# Altium schematic sheet GY_NEO6MV2_Sheet1.SchDoc
size A4; SheetNumber: 6; SheetTotal: 11
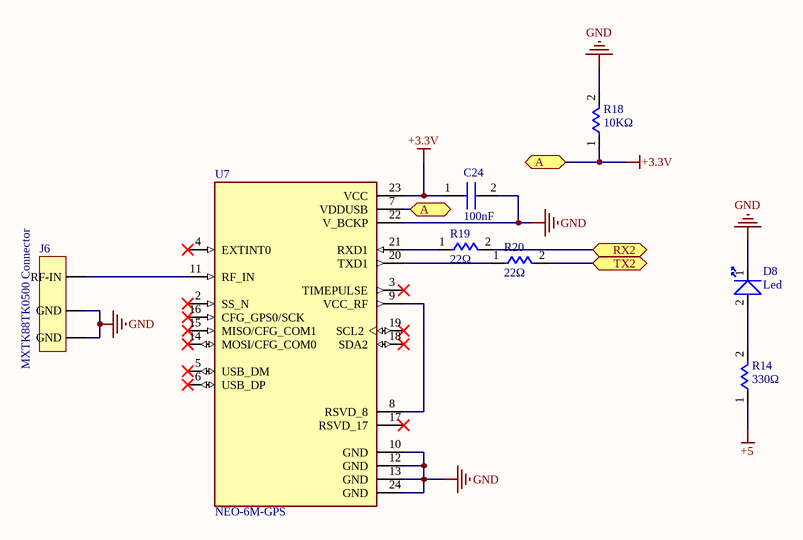
[diagram p0: GY_NEO6MV2_Sheet1.SchDoc]

## Parts
C24  100nF  [CAP - 0603]
D8  Led  [LED - 0603]
J6  MXTK88TK0500 Connector  [MXTK88TK0500 Connector]
R14  330Ω  [RES - 0603]
R18  10KΩ  [RES - 0603]
R19  22Ω  [RES - 0603]
R20  22Ω  [RES - 0603]
U7  NEO-6M-GPS  [XCVR_NEO-6M-GPS]

## Ports
A (bidir), RX2 (bidir), TX2 (bidir)

## Nets
+3.3V: C24.1 R18.1 U7.7(VDDUSB) U7.23(VCC) ; port A
+5: R14.1
GND: C24.2 D8.1 J6.1(GND) J6.2(GND) R18.2 U7.10(GND) U7.12(GND) U7.13(GND) U7.22(V_BCKP) U7.24(GND)
RX2: R19.2 ; port RX2
TX2: R20.2 ; port TX2
NetD8_2: D8.2 R14.2
NetJ6_3: J6.3(RF-IN) U7.11(RF_IN)
NetR19_1: R19.1 U7.21(RXD1)
NetR20_1: R20.1 U7.20(TXD1)
NetU7_8: U7.8(RSVD_8) U7.9(VCC_RF)

Not connected (* = marked no-connect by the designer): U7 2(SS_N)* 3(TIMEPULSE)* 4(EXTINT0)* 5(USB_DM)* 6(USB_DP)* 14(MOSI/CFG_COM0)* 15(MISO/CFG_COM1)* 16(CFG_GPS0/SCK)* 17(RSVD_17)* 18(SDA2)* 19(SCL2)*

## Library data of the parts
C24 = CAP: Capacitor; ComponentLink1Description: Satın Alma Linki; ComponentLink1URL: https://ozdisan.com/pasif-komponentler/kondansatorler/smt-smd-ve-mlcc-kondansatorler/CL10B472KB8NNNC; ComponentLink2Description: Satın Alma Linki; ComponentLink2URL: https://ozdisan.com/pasif-komponentler/kondansatorler/smt-smd-ve-mlcc-kondansatorler/CL10C200JB8NNNC; ComponentLink3Description: Satın Alma Linki; ComponentLink3URL: https://ozdisan.com/pasif-komponentler/kondansatorler/smt-smd-ve-mlcc-kondansatorler/CL10B104KB8NNNC; ComponentLink4Description: Datasheet; ComponentLink4URL: https://cdn.ozdisan.com/ETicaret_Dosya/448212_5798276.PDF; ComponentLink5Description: Satın Alma Linki; ComponentLink5URL: https://ozdisan.com/pasif-komponentler/kondansatorler/smt-smd-ve-mlcc-kondansatorler/CL10C101JB8NNNC
D8 = Led: HL-PST-1608U51GC - LED SMD 0603 GREEN 500mcd 120° WATER CLEAR; ComponentLink1Description: Satın Alma Linki; ComponentLink1URL: https://ozdisan.com/Product/Detail/471660/HL-PST-1608U51GC; ComponentLink2Description: Datasheet; ComponentLink2URL: https://cdn.ozdisan.com/ETicaret_Dosya/471660_7204356.pdf
J6 = MXTK88TK0500 Connector: CABLE ASSEMBLY COAXIAL 0.5m GSC CONN.PL-PL; ComponentLink1Description: Datashet; ComponentLink1URL: https://www.robo90.com/ufl-rf-konnektor-smd-ipex-pcb-konnektor?gclid=Cj0KCQiAjJOQBhCkARIsAEKMtO3EQQtFxcQxxYyV63gND7p49a9U-0KiGjZnTbRHjlZa4_YkA7jEr6QaAmQAEALw_wcB; ComponentLink2Description: Satın Alma Linki; ComponentLink2URL: https://ozdisan.com/konnektor-ve-baglanti-elemanlari/koaksiyel-konnektorler/koaksiyel-kablo-birlestiricileri/MXTK88TK0500
R14 R18-R20 = Res: SMD Res; ComponentLink1Description: Datasheet; ComponentLink1URL: https://cdn.ozdisan.com/ETicaret_Dosya/570122_9878629.pdf; ComponentLink2Description: Satın Alma Linki; ComponentLink2URL: https://www.ozdisan.com/pasif-komponentler/direncler/smt-smd-direncler/TC0325B3301T5C; ComponentLink3Description: Satın Alma Linki; ComponentLink3URL: https://ozdisan.com/pasif-komponentler/direncler/smt-smd-ve-cip-direncler/0603SAF4701T5E; ComponentLink4Description: Satın Alma Linki; ComponentLink4URL: https://ozdisan.com/pasif-komponentler/direncler/smt-smd-ve-cip-direncler/0805S8F604JT5E; ComponentLink5Description: Satın Alma Linki; ComponentLink5URL: https://ozdisan.com/pasif-komponentler/direncler/smt-smd-ve-cip-direncler/0603SAF1022T5E; ComponentLink6Description: Satın Alma Linki; ComponentLink6URL: https://www.ozdisan.com/pasif-komponentler/direncler/smt-smd-direncler/CQ03SAF0000T5E
U7 = NEO-6M-GPS: SMD GPS Module;; MF: u-blox; Availability: Unavailable; MP: NEO-6M-GPS; Package: None; SnapEDA_Link: https://www.snapeda.com/parts/NEO-6M-GPS/u-blox/view-part/105879/?ref=snap; Value: *; Price: None; ComponentLink1Description: Datasheet; ComponentLink1URL: https://cdn.ozdisan.com/ETicaret_Dosya/634963_988117.PDF; ComponentLink2Description: Datasheet; ComponentLink2URL: https://www.u-blox.com/sites/default/files/products/documents/LEA-NEO-MAX-6_HIM_%28UBX-14054794%29.pdf?utm_source=en%2Fimages%2Fdownloads%2FProduct_Docs%2FLEA-6_NEO-6_MAX-6_HardwareIntegrationManual_%28GPS.G6-HW-09007%29.pdf#page=33&zoom=100,72,125; ComponentLink3Description: Satın Alma Linki; ComponentLink3URL: https://www.robo90.com/ufl-rf-konnektor-smd-ipex-pcb-konnektor?gclid=Cj0KCQiAjJOQBhCkARIsAEKMtO3EQQtFxcQxxYyV63gND7p49a9U-0KiGjZnTbRHjlZa4_YkA7jEr6QaAmQAEALw_wcB; ComponentLink4Description: Satın Alma Linki; ComponentLink4URL: https://www.robocombo.com/u-blox-NEO-6M-GPS-Modulu,PR-1278.html